# EAGLE design untitled (EAGLE 9.6.2)
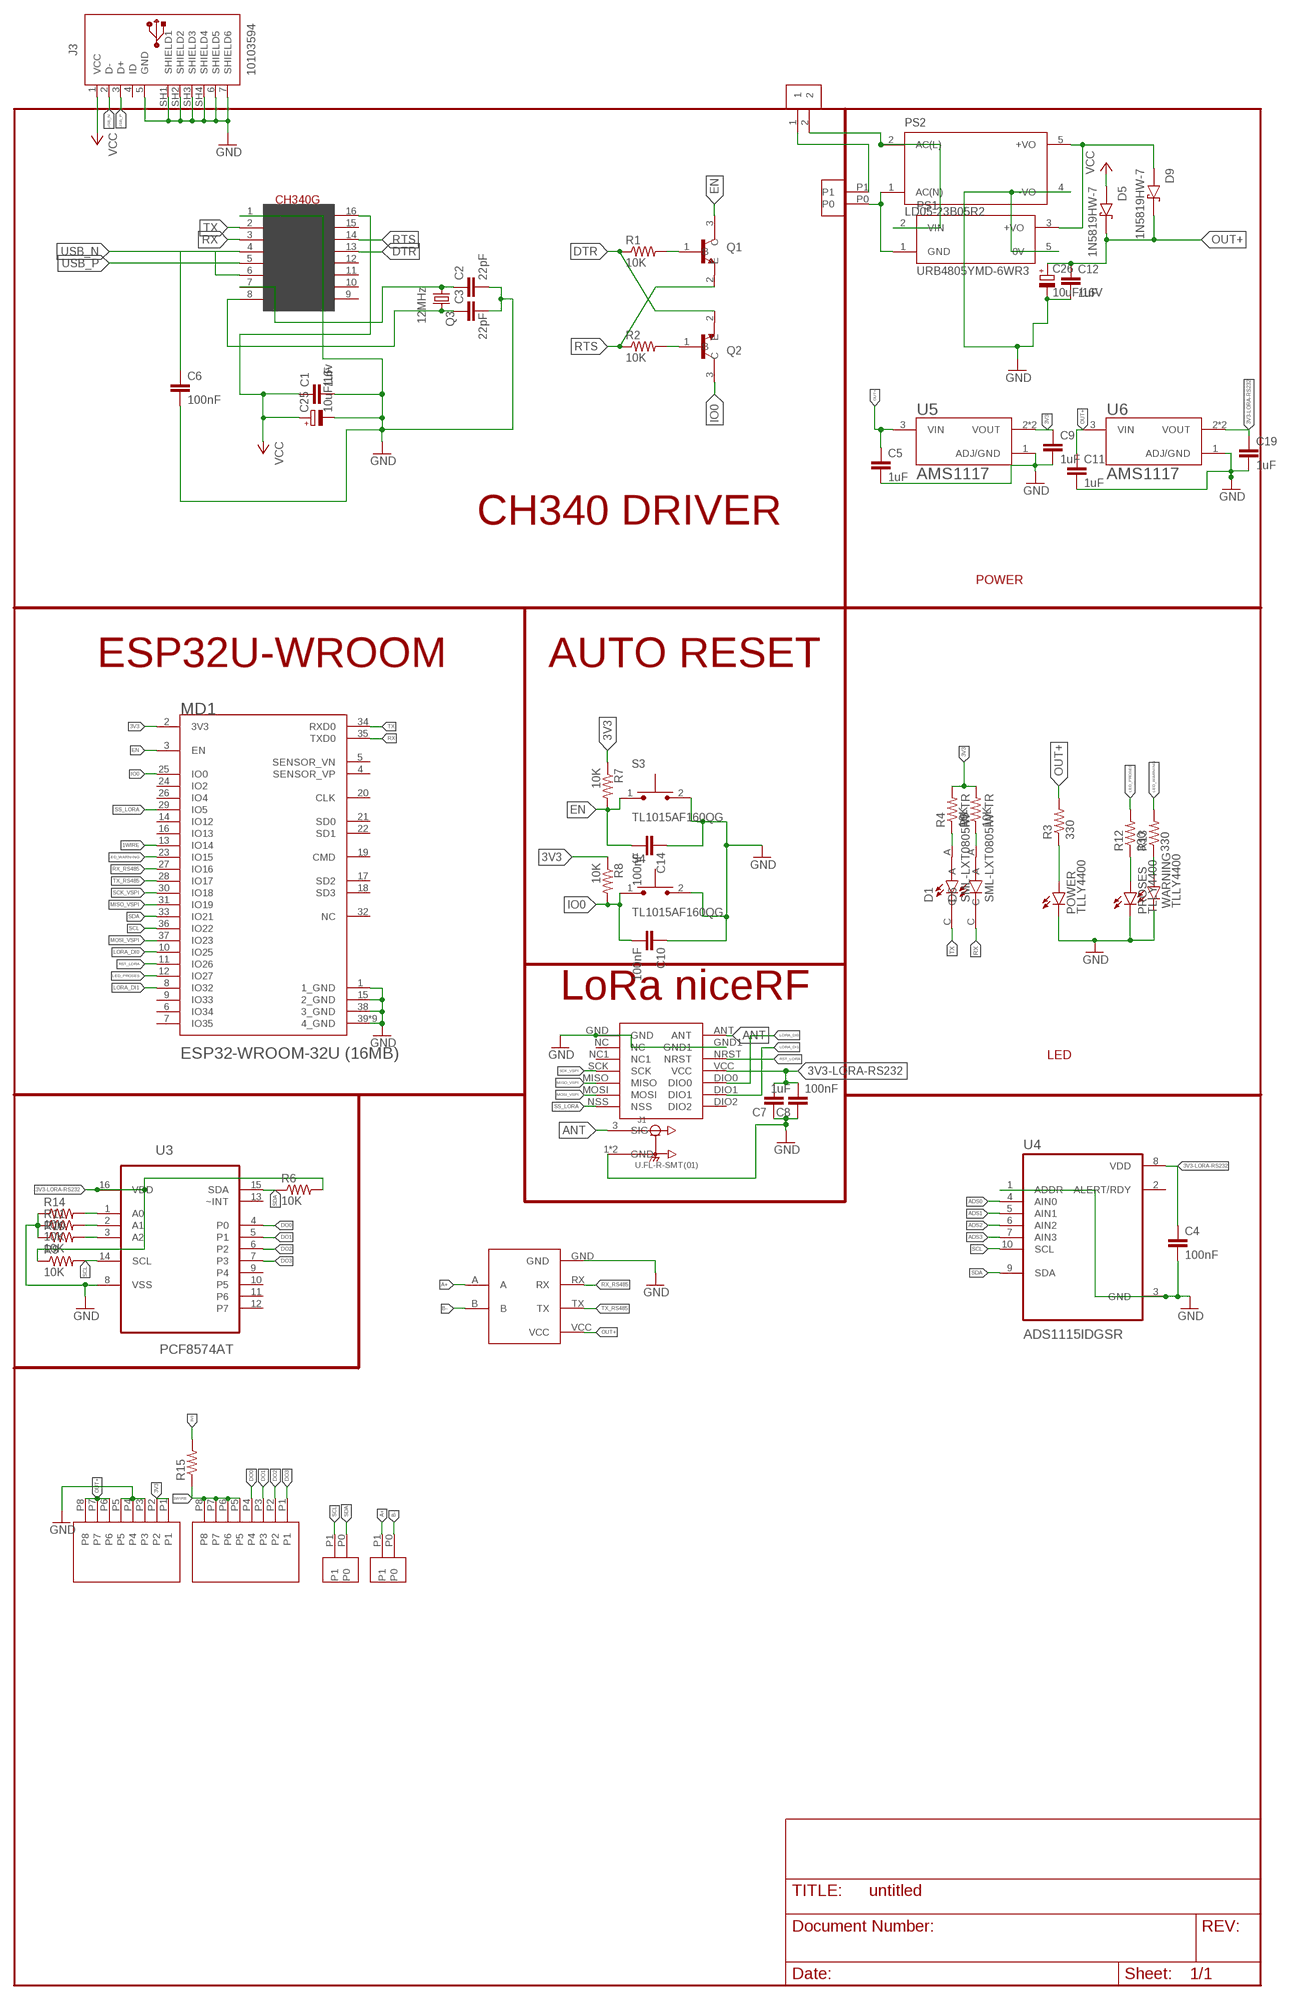
[diagram p0: schematic, sheet 1]

## Parts
C1  1uF  C-EUC0805K  [C0805K]
C2  22pF  C-EUC0805K  [C0805K]
C3  22pF  C-EUC0805K  [C0805K]
C4  100nF  C-EUC0805K  [C0805K]
C5  1uF  C-EUC0805K  [C0805K]
C6  100nF  C-EUC0805K  [C0805K]
C7  1uF  C-EUC0805K  [C0805K]
C8  100nF  C-EUC0805K  [C0805K]
C9  1uF  C-EUC0805K  [C0805K]
C10  100nF  C-EUC0805K  [C0805K]
C11  1uF  C-EUC0805K  [C0805K]
C12  1uF  C-EUC0805K  [C0805K]
C14  100nF  C-EUC0805K  [C0805K]
C19  1uF  C-EUC0805K  [C0805K]
C25  10uF/16v  CPOL-EU153CLV-0505  [153CLV-0505]
C26  10uF/16V  CPOL-EU153CLV-0505  [153CLV-0505]
CONN2P-3.5PI1  CONN2P-3.5PI  [CONN2P-3.5PI]
CONN2P-3.5PI2  CONN2P-3.5PI  [CONN2P-3.5PI]
CONN2P-3.5PI3  CONN2P-3.5PI  [CONN2P-3.5PI]
CONN3.1  CONN3.5  [CONN3.5]
CONN3.2  CONN3.5  [CONN3.5]
D1  SML-LXT0805IW-TR  [LEDC2012X120N]
D5  1N5819HW-7  [SOD3715X145N]
D6  SML-LXT0805IW-TR  [LEDC2012X120N]
D9  1N5819HW-7  [SOD3715X145N]
FUSE-KOTAK1  FUSE-KOTAK  [FUSE-KOTAK]
J1  U.FL-R-SMT(01)  [HRS_U.FL-R-SMT(01)]
J3  10103594  [10103594]
LORA-NICERF-V1  LORA-NICERF-V2  [LORA-NICERF-V2]
MD1  ESPRESSIF_SYSTEMS_ESP32-WROOM-32U_16MBESPRESSIF_SYSTEMS_ESP32-WROOM-32U_16MB_0_0  [ESPRESSIF_SYSTEMS_ESP32-WROOM-32U_16MB_0]
POWER  TLLY4400  [LED3MM]
PROSES  TLLY4400  [LED3MM]
PS1  URB4805YMD-6WR3  [CONV_URB4805YMD-6WR3]
PS2  LD05-23B05R2  [CONV_LD05-23B05R2]
Q1  MMBT3904  [SOT95P240X120-3N]
Q2  MMBT3904  [SOT95P240X120-3N]
Q3  12MHz  CRYSTALSM49  [SM49]
R1  10K  R-US_M0805  [M0805]
R2  10K  R-US_M0805  [M0805]
R3  330  R-US_M0805  [M0805]
R4  10K  R-US_M0805  [M0805]
R5  10K  R-US_M0805  [M0805]
R6  10K  R-US_M0805  [M0805]
R7  10K  R-US_M0805  [M0805]
R8  10K  R-US_M0805  [M0805]
R9  10K  R-US_M0805  [M0805]
R10  10K  R-US_M0805  [M0805]
R11  10K  R-US_M0805  [M0805]
R12  330  R-US_M0805  [M0805]
R13  330  R-US_M0805  [M0805]
R14  10K  R-US_M0805  [M0805]
R15  R-US_0207/10  [0207/10]
S3  TL1015AF160QG  [SW_TL1015AF160QG]
S4  TL1015AF160QG  [SW_TL1015AF160QG]
TTL-RS1  TTL-RS485  [TTL-RS485]
U3  PCF8574AT  [SOIC127P1032X265-16N]
U4  ADS1115IDGSR  [SOP50P490X110-10N]
U5  AMS1117  [SOT229P700X180-4N]
U6  AMS1117  [SOT229P700X180-4N]
U$2  CH340G  [SOIC16]
WARNING  TLLY4400  [LED3MM]

## Nets
1WIRE: CONN3.2.P5 CONN3.2.P6 CONN3.2.P7 CONN3.2.P8 MD1.13(IO14) R15.1
3V3: C9.1 CONN3.1.P1 CONN3.1.P2 MD1.2(3V3) R4.2 R5.2 R7.1 R8.1 R15.2 U5.2(VOUT) U5.4(VOUT)
3V3-LORA-RS232: C4.1 C7.2 C8.2 C19.1 LORA-NICERF-V1.VCC R6.2 R9.1 U3.16(VDD) U4.8(VDD) U6.2(VOUT) U6.4(VOUT)
A+: CONN2P-3.5PI3.P1 TTL-RS1.A
ADS0: U4.4(AIN0)
ADS1: U4.5(AIN1)
ADS2: U4.6(AIN2)
ADS3: U4.7(AIN3)
ANT: J1.3(SIG) LORA-NICERF-V1.ANT
B-: CONN2P-3.5PI3.P0 TTL-RS1.B
DO0: CONN3.2.P4 U3.4(P0)
DO1: CONN3.2.P3 U3.5(P1)
DO2: CONN3.2.P2 U3.6(P2)
DO3: CONN3.2.P1 U3.7(P3)
DTR: Q2.2(E) R1.1 U$2.13(DTR)
EN: C14.2 MD1.3(EN) Q1.3(C) R7.2 S3.1
GND: C1.2 C2.2 C3.2 C4.2 C5.2 C6.2 C7.1 C8.1 C9.2 C10.1 C11.2 C12.2 C14.1 C19.2 C25.- C26.- CONN3.1.P3 CONN3.1.P4 CONN3.1.P5 J1.1(GND) J1.2(GND) J3.5(GND) J3.6(SHIELD5) J3.7(SHIELD6) J3.SH1(SHIELD1) J3.SH2(SHIELD2) J3.SH3(SHIELD3) J3.SH4(SHIELD4) LORA-NICERF-V1.GND LORA-NICERF-V1.GND1 MD1.1(1_GND) MD1.15(2_GND) MD1.38(3_GND) MD1.39(4_GND) MD1.39-2(4_GND) MD1.39-3(4_GND) MD1.39-4(4_GND) MD1.39-5(4_GND) MD1.39-6(4_GND) MD1.39-7(4_GND) MD1.39-8(4_GND) MD1.39-9(4_GND) POWER.K(C) PROSES.K(C) PS1.5(0V) PS2.4(-VO) R10.1 R11.1 R14.1 S3.2 S4.2 TTL-RS1.GND U3.8(VSS) U4.1(ADDR) U4.3(GND) U5.1(ADJ/GND) U6.1(ADJ/GND) U$2.1(GND) WARNING.K(C)
IO0: C10.2 MD1.25(IO0) Q2.3(C) R8.2 S4.1
LED_PROSES: MD1.12(IO27) R12.2
LED_WARNING: MD1.23(IO15) R13.2
LORA_DI0: LORA-NICERF-V1.DIO0 MD1.10(IO25)
LORA_DI1: LORA-NICERF-V1.DIO1 MD1.8(IO32)
MISO_VSPI: LORA-NICERF-V1.MISO MD1.31(IO19)
MOSI_VSPI: LORA-NICERF-V1.MOSI MD1.37(IO23)
N$1: C2.1 Q3.1 U$2.7(XI)
N$2: C3.1 Q3.2 U$2.8(XO)
N$3: POWER.A R3.1
N$4: Q1.1(B) R1.2
N$5: Q2.1(B) R2.2
N$6: CONN2P-3.5PI1.P0 PS1.1(GND) PS2.1(AC(N))
N$7: CONN2P-3.5PI1.P1 FUSE-KOTAK1.1
N$8: D1.A R4.1
N$9: D6.A R5.1
N$10: R14.2 U3.1(A0)
N$12: C6.1 U$2.4(V3)
N$13: FUSE-KOTAK1.2 PS1.2(VIN) PS2.2(AC(L))
N$14: R11.2 U3.2(A1)
N$15: R10.2 U3.3(A2)
N$16: D9.A PS1.3(+VO) PS2.5(+VO)
N$25: PROSES.A R12.1
N$28: R13.1 WARNING.A
OUT+: C5.1 C11.1 C12.1 C26.+ CONN3.1.P6 CONN3.1.P7 CONN3.1.P8 D5.C(K) D9.C(K) R3.2 TTL-RS1.VCC U5.3(VIN) U6.3(VIN)
RST_LORA: LORA-NICERF-V1.NRST MD1.11(IO26)
RTS: Q1.2(E) R2.1 U$2.14(RTS)
RX: D6.C MD1.35(TXD0) U$2.3(RX)
RX_RS485: MD1.27(IO16) TTL-RS1.RX
SCK_VSPI: LORA-NICERF-V1.SCK MD1.30(IO18)
SCL: CONN2P-3.5PI2.P1 MD1.36(IO22) R9.2 U3.14(SCL) U4.10(SCL)
SDA: CONN2P-3.5PI2.P0 MD1.33(IO21) R6.1 U3.15(SDA) U4.9(SDA)
SS_LORA: LORA-NICERF-V1.NSS MD1.29(IO5)
TX: D1.C MD1.34(RXD0) U$2.2(TX)
TX_RS485: MD1.28(IO17) TTL-RS1.TX
USB_N: J3.2(D-) U$2.6(D-)
USB_P: J3.3(D+) U$2.5(D+)
VCC: C1.1 C25.+ D5.A J3.1(VCC) U$2.16(VCC)
Unconnected: J3.4(ID) LORA-NICERF-V1.DIO2 LORA-NICERF-V1.NC LORA-NICERF-V1.NC1 MD1.4(SENSOR_VP) MD1.5(SENSOR_VN) MD1.6(IO34) MD1.7(IO35) MD1.9(IO33) MD1.14(IO12) MD1.16(IO13) MD1.17(SD2) MD1.18(SD3) MD1.19(CMD) MD1.20(CLK) MD1.21(SD0) MD1.22(SD1) MD1.24(IO2) MD1.26(IO4) MD1.32(NC) U3.9(P4) U3.10(P5) U3.11(P6) U3.12(P7) U3.13(~INT) U4.2(ALERT/RDY) U$2.9(CTS) U$2.10(DSR) U$2.11(RI) U$2.12(DCD) U$2.15(RS232)

## Notes on the sheet
- CH340 DRIVER
- POWER
- ESP32U-WROOM | AUTO RESET
- LoRa niceRF
- LED

## Library data of the parts
C1-C12 C14 C19 = rcl:C-EU: CAPACITOR, European symbol; SPICEPREFIX: C
C25 C26 = rcl:CPOL-EU: POLARIZED CAPACITOR, European symbol; SPICEPREFIX: C
CONN2P-3.5PI1-CONN2P-3.5PI3 = CONN2P-3.5PI:CONN2P-3.5PI
CONN3.1 CONN3.2 = CONN3.5:CONN3.5
D1 D6 = SML-LXT0805IW-TR:SML-LXT0805IW-TR: LED; Luminous Intensity:11µcd; Viewing Angle:140°; Forward Current:30mA; Forward Voltage:2V; Color:Red; LED Color:Red; Leaded Process Compatible:Yes; Lens Color:White; Mounting Type:Surface Mount ;RoHS Compliant: Yes Check availability <https://pricing.snapeda.com/parts/SML-LXT0805IW-TR/Lumex%20Opto/Components/view-part?ref=eda>; AVAILABILITY: In Stock; DESCRIPTION: Red - LED Indication - Discrete 2V 0805 (2012 Metric); MF: Lumex Opto/Components; MP: SML-LXT0805IW-TR; PACKAGE: 0805 Lumex; PRICE: None; PURCHASE-URL: https://pricing.snapeda.com/search/part/SML-LXT0805IW-TR/?ref=eda
D5 D9 = 1N5819HW-7:1N5819HW-7: 1N5819HW Series 40 V 1 A Surface Mount Schottky Barrier Rectifier - SOD-123 Check availability <https://pricing.snapeda.com/parts/1N5819HW-7/Diodes%20Inc./view-part?ref=eda>; AVAILABILITY: In Stock; DESCRIPTION: Diode Schottky 40 V 1A Surface Mount SOD-123; MF: Diodes Inc.; MP: 1N5819HW-7; PACKAGE: SOD-123 Fairchild Semiconductor; PRICE: None; PURCHASE-URL: https://pricing.snapeda.com/search/part/1N5819HW-7/?ref=eda
FUSE-KOTAK1 = FUSE-KOTAK:FUSE-KOTAK
J1 = U.FL-R-SMT_01_:U.FL-R-SMT(01): U.FL Series 6 Ghz 50 Ohm Ultra-small SMT Coaxial Cable Receptacle Check availability <https://pricing.snapeda.com/parts/U.FL-R-SMT%2801%29/Hirose/view-part?ref=eda>; AVAILABILITY: In Stock; DESCRIPTION: U.FL (UMCC) Connector Receptacle, Male Pin 50Ohm Surface Mount Solder. RF Connectors / Coaxial Connectors; MF: Hirose; MP: U.FL-R-SMT(01); PACKAGE: None; PRICE: None; PURCHASE-URL: https://pricing.snapeda.com/search/part/U.FL-R-SMT(01)/?ref=eda
J3 = Connector_USB:10103594: USB(2.0) Micro-B, RCPT, 5POS, SMD-THT-R/A Datasheet <https://cdn.amphenol-icc.com/media/wysiwyg/files/documentation/datasheet/inputoutput/io_usb_micro.pdf> Drawing <https://cdn.amphenol-icc.com/media/wysiwyg/files/drawing/10103594.pdf>; CATEGORY: Connectors; CONTACTS: 5; CURRENT-RATING: 1.8A; DESCRIPTION: CONN RCPT USB2.0 MICRO B SMD R/A; GENDER: Receptacle; MANUFACTURER: Amphenol ICC (FCI); MOUNT_TYPE: R/A; MPN: 10103594-0001LF; OPERATING_TEMPERATURE: -30°C ~ 80°C; PART_STATUS: ACTIVE; ROHS_COMPLIANT: COMPLIANT; SUB_CATEGORY: USB; TYPE: USB-micro B; VOLTAGE-RATING: 100VAC
LORA-NICERF-V1 = LORA-NICERF-V2:LORA-NICERF-V2
MD1 = Espressif Systems - ESP32-WROOM-32U (16MB):ESPRESSIF_SYSTEMS_ESP32-WROOM-32U_16MB: Bluetooth, WiFi 802.11b/g/n, Bluetooth v4.2 +EDR, Class 1, 2 and 3 Transceiver Module 2.4GHz ~ 2.5GHz Antenna Not Included, U.FL Surface Mount; AUTOMOTIVE: No; BANDWIDTH: 72MHz; CENTROID_NOT_SPECIFIED: No; DATASHEET: https://www.espressif.com/sites/default/files/documentation/esp32-wroom-32d_esp32-wroom-32u_datasheet_en.pdf; DATA_RATE: 150Mbits/s; DEVICE_CLASS_L1: Integrated Circuits (ICs); DEVICE_CLASS_L2: RF Semiconductors and Devices; DEVICE_CLASS_L3: Transceivers; DIGIKEY_DESCRIPTION: RX TXRX MODULE WIFI U.FL SMD; DIGIKEY_PART_NUMBER: 1904-1028-1-ND; FOOTPRINT_VARIANT_NAME_0: Recommended_Land_Pattern; HEIGHT: 3.35mm; INTERFACE: I2C,SPI,UART,Ethernet,I2S,Other; LEAD_FREE: Yes; MAX_FREQUENCY: 2484MHz; MAX_SUPPLY_VOLTAGE: 3.6V; MF: Espressif Systems; MFG_PACKAGE_IDENT: 0; MFG_PACKAGE_IDENT_DATE: 0; MFG_PACKAGE_IDENT_REV: 0; MIN_SUPPLY_VOLTAGE: 3V; MOUSER_PART_NUMBER: 356-ES32WROOM32U16MB; MPN: ESP32-WROOM-32U (16MB); NOMINAL_SUPPLY_CURRENT: 0.5A; NUMBER_OF_ADC_CHANNELS: 16; NUMBER_OF_GPIO: 26; PACKAGE: BT_MODULE; PREFIX: MD; ROHS: Yes; SENSITIVITY: -98dBm; TEMPERATURE_RANGE_HIGH: +85°C; TEMPERATURE_RANGE_LOW: -40°C; VERIFICATION_VERSION: 0.0.0.3
POWER PROSES WARNING = led:TLLY4400: Low Current (2mA) LED 3 mm Tinted Diffused Package color YELLOW Source: Data sheet <http://www.farnell.com/datasheets/391098.pdf>; MF: VISHAY SEMICONDUCTOR; OC_FARNELL: 1612439
PS1 = URB4805YMD-6WR3:URB4805YMD-6WR3: DC/DC Converter Check availability <https://pricing.snapeda.com/parts/URB4805YMD-6WR3/Mornsun%20America%2C%20LLC/view-part?ref=eda>; AVAILABILITY: In Stock; DESCRIPTION: Isolated Module DC DC Converter 1 Output 5V - - - 1.2A 18V - 75V Input; MF: Mornsun America, LLC; MP: URB4805YMD-6WR3; PACKAGE: CUSTOM-5 MORNSUN; PRICE: None; PURCHASE-URL: https://pricing.snapeda.com/search?q=URB4805YMD-6WR3&ref=eda
PS2 = LD05-23B05R2:LD05-23B05R2: AC/DC Converter Check availability <https://pricing.snapeda.com/parts/LD05-23B05R2/Mornsun%20America%2C%20LLC/view-part?ref=eda>; AVAILABILITY: In Stock; DESCRIPTION: Enclosed AC DC Converters 1 Uitgang 5V - - - 1A 85 ~ 305 VAC, 100 ~ 430 VDC Input; MF: Mornsun America, LLC; MP: LD05-23B05R2; PACKAGE: CUSTOM-4 MORNSUN; PRICE: None; PURCHASE-URL: https://pricing.snapeda.com/search/part/LD05-23B05R2/?ref=eda
Q1 Q2 = MMBT3904:MMBT3904: MMBT3904 Series 40 V CE Breakdown 0.2 A NPN General Purpose Amplifier - SOT-23 Check availability <https://pricing.snapeda.com/parts/MMBT3904/STMicroelectronics/view-part?ref=eda>; AVAILABILITY: Not in stock; DESCRIPTION: SMD Transistor MMBT3904 SOT-23 SMD DIOTEC; MF: STMicroelectronics; MP: MMBT3904; PACKAGE: SOT-23 ON; PRICE: None
Q3 = adafruit:CRYSTAL: CRYSTAL; OC_FARNELL: unknown; OC_NEWARK: unknown
R1-R15 = adafruit:R-US_: RESISTOR, American symbol
S3 S4 = TL1015AF160QG:TL1015AF160QG: Tactile Switch SPST-NO Top Actuated Surface Mount Check availability <https://pricing.snapeda.com/parts/TL1015AF160QG/E-Switch/view-part?ref=eda>; AVAILABILITY: In Stock; DESCRIPTION: Tactile Switch SPST-NO Top Actuated Surface Mount; MF: E-Switch; MP: TL1015AF160QG; PACKAGE: None; PRICE: None; PURCHASE-URL: https://pricing.snapeda.com/search/part/TL1015AF160QG/?ref=eda
TTL-RS1 = TTL-RS485:TTL-RS485
U3 = PCF8574AT:PCF8574AT: Remote 8-bit I/O expander for I2C-bus Check availability <https://pricing.snapeda.com/parts/PCF8574AT/NXP%20USA/view-part?ref=eda>; AVAILABILITY: In Stock; DESCRIPTION: I²C Bus IC Operating temperature: -40...+85 °C Power supply: 2.5...6 V Package: SO-16W; MF: NXP USA; MP: PCF8574AT; PACKAGE: SOIC-16 NXP USA; PRICE: None; PURCHASE-URL: https://pricing.snapeda.com/search/part/PCF8574AT/?ref=eda
U4 = ADS1115IDGSR:ADS1115IDGSR: Check availability <https://pricing.snapeda.com/parts/ADS1115IDGSR/Texas%20Instruments/view-part?ref=eda>; AVAILABILITY: In Stock; DESCRIPTION: 16-bit, 860-SPS, 4-channel, delta-sigma ADC with PGA, oscillator, VREF, comparator and I2C; MF: Texas Instruments; MP: ADS1115IDGSR; PACKAGE: VSSOP-10 Texas Instruments; PRICE: None; PURCHASE-URL: https://pricing.snapeda.com/search/part/ADS1115IDGSR/?ref=eda
U5 U6 = AMS1117:AMS1117: Sot223/Pkg 1-Amp 5-Volt Low Drop Out Voltage Regulatator Check availability <https://pricing.snapeda.com/parts/AMS1117/Advanced%20Monolithic%20Systems/view-part?ref=eda>; AVAILABILITY: Not in stock; DESCRIPTION: 1A LOW DROPOUT VOLTAGE REGULATOR SOT-223; MF: Advanced Monolithic Systems; MP: AMS1117; PACKAGE: SOT-223 Seeed Technology; PRICE: None
U$2 = usb-serial:CH340G

## Net classes
0 default: width 0.2 mm, clearance 0.15 mm

## Board
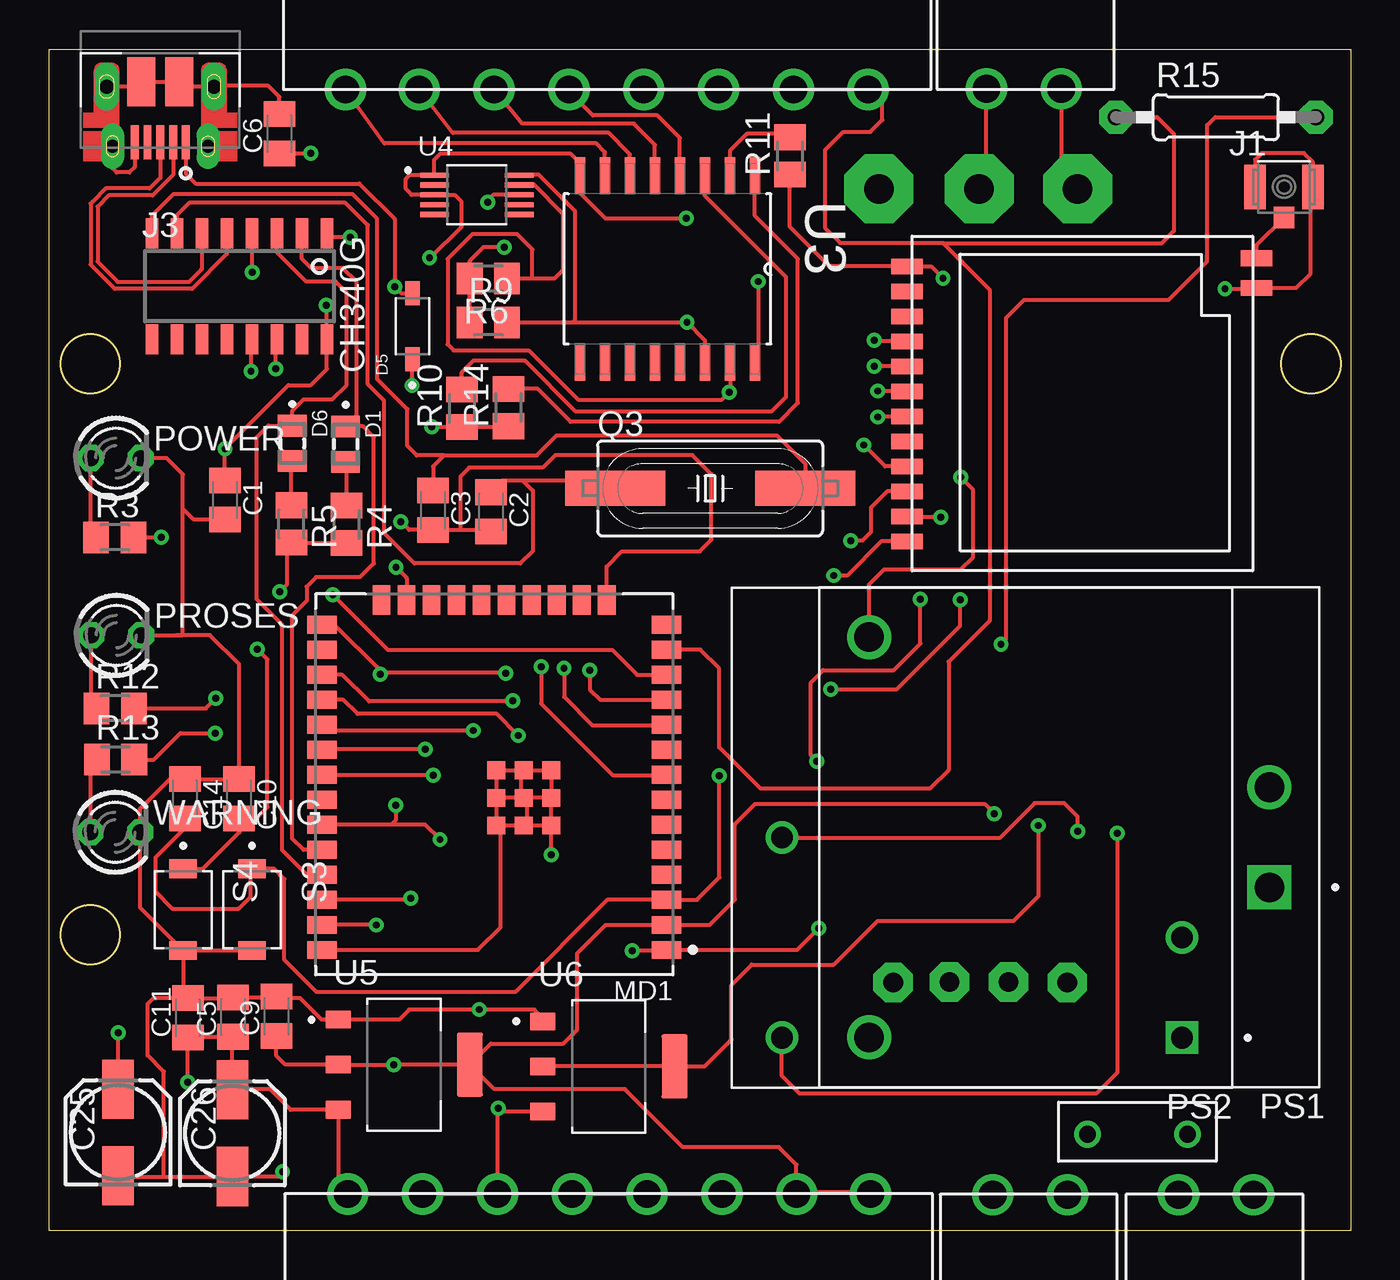
[diagram p1: board, top side]
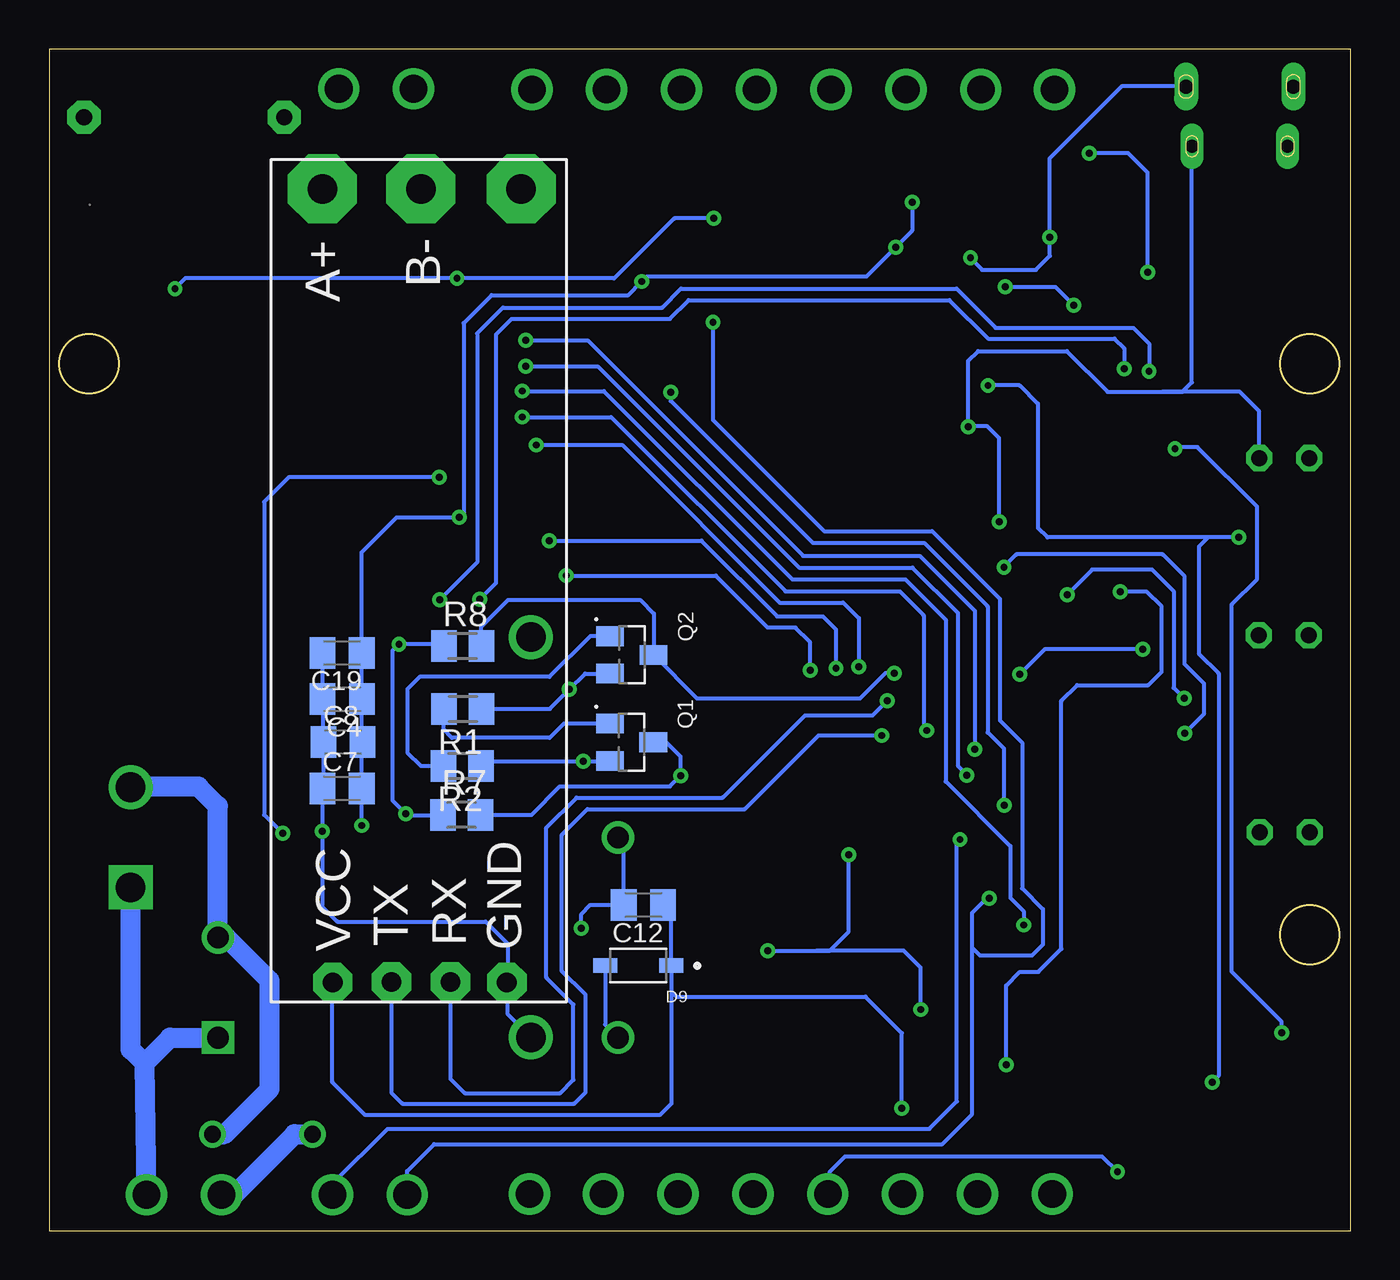
[diagram p2: board, bottom side, seen from below]

Size 66.1 x 60 mm. Coordinates in mm from the lower left corner, seen from the top.
Outline: 66.1,0 0,0 0,60 66.1,60 66.1,0
Outline: circle at 64.08,44.04 radius 1.5
Outline: circle at 2.08,44.04 radius 1.5
Outline: circle at 2.08,15.04 radius 1.5
Copper layers (1*16): Top 0.035mm / dielectric 1.5mm / Bottom 0.035mm
Design rules "default": minimum track width 6mil, minimum drill 0.35mm, track to track 6mil, track to pad 6mil, pad to pad 6mil, via to via 6mil, smd to smd 6mil, copper to edge 40mil, drill to drill 6mil, minimum pad ring 10mil, minimum via ring 8mil, stop-mask expansion 4mil, vias tented up to drill 0mil, thermal gap 10mil

### Footprints (pad centres in the part's own frame; a part is rotated, then mirrored left to right if it is on the bottom)
C0805K = smd 1.3 x 1.6: 1 -1,0; 2 1,0
153CLV-0505 = smd 3 x 1.6: + 2.2,0; - -2.2,0
CONN2P-3.5PI = drill 1.4: P0 2.521,0.016; P1 6.321,0.016
CONN3.5 = drill 1.4: P1 -26.75,0; P2 -23,0; P3 -19.2,0; P4 -15.4,0; P5 -11.6,0; P6 -7.8,0; P7 -4,0; P8 -0.2,0
LEDC2012X120N = smd 1.1 x 1.45: A 0.9,0; C -0.9,0
SOD3715X145N = smd 1.21 x 0.73: A 1.68,0; C -1.68,0
FUSE-KOTAK = drill 0.85: 1 -5.54,-0.62; 2 -0.46,-0.62
HRS_U.FL-R-SMT(01) = smd 1.1 x 2.25: 1 -1.475,0; 2 1.475,0 | smd 1.05 x 1.1: 3 0,-1.55
10103594 = smd 0.4 x 1.75: 1 -1.3,2.825; 2 -0.65,2.825; 3 0,2.825; 4 0.65,2.825; 5 1.3,2.825 | smd 1.425 x 2.5: 6 -0.963,-0.25; 7 0.963,-0.25 | drill 0.65 pad 0.73 long: SH1 -2.425,3.03; SH2 2.425,3.03 | drill 0.7 long: SH3 -2.725,0; SH4 2.725,0
LORA-NICERF-V2 = smd 1.6 x 0.8: ANT 9.17,6.81; DIO0 -8.57,-5.03; DIO1 -8.57,-3.76; DIO2 -8.57,-2.49; GND -8.57,6.4; GND1 9.17,5.31; MISO -8.57,1.32; MOSI -8.57,0.05; NC -8.57,5.13; NC1 -8.57,3.86; NRST -8.57,-7.57; NSS -8.57,-1.22; SCK -8.57,2.59; VCC -8.57,-6.3
ESPRESSIF_SYSTEMS_ESP32-WROOM-32U_16MB_0 = smd 1.5 x 0.9: 1 -8.75,8.41; 2 -8.75,7.14; 3 -8.75,5.87; 4 -8.75,4.6; 5 -8.75,3.33; 6 -8.75,2.06; 7 -8.75,0.79; 8 -8.75,-0.48; 9 -8.75,-1.75; 10 -8.75,-3.02; 11 -8.75,-4.29; 12 -8.75,-5.56; 13 -8.75,-6.83; 14 -8.75,-8.1; 25 8.75,-8.1; 26 8.75,-6.83; 27 8.75,-5.56; 28 8.75,-4.29; 29 8.75,-3.02; 30 8.75,-1.75; 31 8.75,-0.48; 32 8.75,0.79; 33 8.75,2.06; 34 8.75,3.33; 35 8.75,4.6; 36 8.75,5.87; 37 8.75,7.14; 38 8.75,8.41 | smd 0.9 x 1.5: 15 -5.71,-9.35; 16 -4.44,-9.35; 17 -3.17,-9.35; 18 -1.9,-9.35; 19 -0.63,-9.35; 20 0.64,-9.35; 21 1.91,-9.35; 22 3.18,-9.35; 23 4.45,-9.35; 24 5.72,-9.35 | smd 0.9 x 0.9: 39 -2.9,2.09; 39-2 -1.5,0.69; 39-3 -1.5,2.09; 39-4 -0.1,2.09; 39-5 -0.1,-0.71; 39-6 -1.5,-0.71; 39-7 -2.9,-0.71; 39-8 -0.1,0.69; 39-9 -2.9,0.69
LED3MM = drill 0.813 octagon: A -1.27,0; K 1.27,0
CONV_URB4805YMD-6WR3 = drill 1.5 square: 1 -10.16,2.54 | drill 1.5: 2 -10.16,-2.54; 3 10.16,-10.16; 5 10.16,10.16
CONV_LD05-23B05R2 = drill 1.1 square: 1 -10.16,10.16 | drill 1.1: 2 -10.16,5.08; 4 10.16,0; 5 10.16,10.16
SOT95P240X120-3N = smd 1 x 1.4: 1 -0.95,-1.1; 2 0.95,-1.1; 3 0,1.1
SM49 = smd 5.08 x 1.778: 1 -4.826,0; 2 4.826,0
M0805 = smd 1.3 x 1.6: 1 -0.95,0; 2 0.95,0
0207/10 = drill 0.813 pad 1.676 octagon: 1 -5.08,0; 2 5.08,0
SW_TL1015AF160QG = smd 0.95 x 1.4: 1 -2.075,0; 2 2.075,0
TTL-RS485 = drill 1.5 pad 3.5 octagon: A -19.7,-6; B -19.7,-1; P$7 -19.7,4.1 | drill 1 pad 2 octagon: GND 20.6,3.37; RX 20.581,0.505; TX 20.583,-2.493; VCC 20.6,-5.47
SOIC127P1032X265-16N = smd 1.803 x 0.533: 1 -4.775,4.445; 2 -4.775,3.175; 3 -4.775,1.905; 4 -4.775,0.635; 5 -4.775,-0.635; 6 -4.775,-1.905; 7 -4.775,-3.175; 8 -4.775,-4.445; 9 4.775,-4.445; 10 4.775,-3.175; 11 4.775,-1.905; 12 4.775,-0.635; 13 4.775,0.635; 14 4.775,1.905; 15 4.775,3.175; 16 4.775,4.445
SOP50P490X110-10N = smd 1.47 x 0.28: 1 -2.15,1; 2 -2.15,0.5; 3 -2.15,0; 4 -2.15,-0.5; 5 -2.15,-1; 6 2.15,-1; 7 2.15,-0.5; 8 2.15,0; 9 2.15,0.5; 10 2.15,1
SOT229P700X180-4N = smd 1.31 x 0.93: 1 -3.345,2.29; 2 -3.345,0; 3 -3.345,-2.29 | smd 1.31 x 3.24: 4 3.345,0
SOIC16 = smd 0.635 x 1.524: 1 -4.445,-2.695; 2 -3.175,-2.695; 3 -1.905,-2.695; 4 -0.635,-2.695; 5 0.635,-2.695; 6 1.905,-2.695; 7 3.175,-2.695; 8 4.445,-2.695; 9 4.445,2.695; 10 3.175,2.695; 11 1.905,2.695; 12 0.635,2.695; 13 -0.635,2.695; 14 -1.905,2.695; 15 -3.175,2.695; 16 -4.445,2.695

### Placement (x,y rotation side)
C1  8.93,37.11 270 top
C2  22.44,36.5 270 top
C3  19.49,36.59 270 top
C4  51.22,26.99 180 bottom
C5  9.34,10.85 90 top
C6  11.69,55.7 90 top
C7  51.23,22.46 0 bottom
C8  51.18,24.81 0 bottom
C9  11.54,10.89 90 top
C10  9.64,21.93 270 top
C11  7.04,10.81 90 top
C12  35.92,16.54 180 bottom
C14  6.89,21.93 270 top
C19  51.23,29.34 180 bottom
C25  3.5,4.99 90 top
C26  9.3,4.95 90 top
CONN2P-3.5PI1  63.68,1.84 180 top
CONN2P-3.5PI2  54.24,1.84 180 top
CONN2P-3.5PI3  45.08,57.98 0 top
CONN3.1  14.96,1.87 180 top
CONN3.2  41.79,57.96 0 top
D1  15.05,39.94 270 top
D5  18.44,45.93 90 top
D6  12.34,39.98 270 top
D9  36.19,13.46 180 bottom
FUSE-KOTAK1  58.27,5.52 0 top
J1  62.71,53 0 top
J3  5.64,58.1 180 top
LORA-NICERF-V1  52.14,42.57 0 top
MD1  22.6,22.67 180 top
POWER  3.38,39.24 0 top
PROSES  3.41,30.24 0 top
PS1  51.8,19.98 180 top
PS2  47.37,19.96 180 top
Q1  36.52,24.8 270 bottom
Q2  36.51,29.24 270 bottom
Q3  33.56,37.7 0 top
R1  45.1,26.5 180 bottom
R2  45.12,23.6 180 bottom
R3  3.33,35.21 0 top
R4  15.1,35.87 270 top
R5  12.29,35.89 270 top
R6  22.31,48.36 180 top
R7  45.16,21.12 0 bottom
R8  45.1,29.68 0 bottom
R9  22.31,46.12 0 top
R10  20.96,41.77 90 top
R11  37.61,54.58 90 top
R12  3.35,26.52 0 top
R13  3.37,23.92 0 top
R14  23.32,41.8 90 top
R15  59.25,56.55 0 top
S3  10.3,16.3 270 top
S4  6.8,16.3 270 top
TTL-RS1  46.23,33.21 270 bottom
U3  31.4,48.85 270 top
U4  21.72,52.61 0 top
U5  18.02,8.43 0 top
U6  28.42,8.34 0 top
U$2  9.66,47.97 180 top
WARNING  3.35,20.24 0 top

### Tracks (layer width: path | path; a pad name or v marks a point on that pad's centre or on a via)
1WIRE
  Top 0.203: 45.42,50.13 47.76,47.8 47.76,30.98 45.67,28.9 45.67,23.39 44.73,22.44 36.13,22.44 34.02,24.55 34.02,28.56 33.07,29.51 MD1.13 | CONN3.2.P5 CONN3.2.P6 CONN3.2.P7 CONN3.2.P8 42.31,57.94 42.31,56.41 41.7,55.8 40.33,55.8 39.39,54.86 39.39,50.95 40.16,50.17 45.39,50.17 45.42,50.13 | R15.1 56.27,56.55 57.12,55.7 57.12,50.77 56.48,50.13 45.42,50.13
3V3  (via drill 0.35)
  Top 0.203: 12.27,34.96 R5.2 | U5.4 v17.5,8.43 U5.2 11.99,8.43 11.54,8.88 C9.1 | CONN3.1.P2 38.46,1.95 | U5.4 22.61,7.18 29.23,7.18 32.17,4.24 37.06,4.24 37.94,3.36 37.94,1.95 38.46,1.95 | CONN3.1.P1 42.38,1.95 38.46,1.95 | U5.4 22.44,9.5 26.1,9.5 26.81,10.2 26.81,14.08 28.25,15.53 MD1.2 33.53,15.53 34.82,16.81 34.82,20.64 35.85,21.67 47.5,21.67 v48,21.17 | v48.33,29.79 48.6,30.05 48.6,46.36 49.51,47.27 56.85,47.27 58.81,49.23 58.81,56.14 59.22,56.55 R15.2 | R5.2 15.08,34.94 R4.2 | v11.71,32.45 12.06,32.8 12.06,34.71 R5.2
  Bottom 0.203: R7.1 46.14,21.09 47.91,21.09 v48,21.17 48.64,21.82 48.64,29.48 v48.33,29.79 46.16,29.79 R8.1 | v17.5,8.43 17.5,12.44 16.8,13.14 15.87,13.14 14.7,14.31 14.7,26.9 13.9,27.7 10.29,27.7 9.61,28.38 9.61,31.7 10.35,32.45 v11.71,32.45
3V3-LORA-RS232  (via drill 0.35)
  Top 0.203: U6.2 U6.4 33.29,8.34 34.65,9.7 34.65,12.47 35.68,13.51 39.84,13.51 42.07,15.74 48.98,15.74 50.25,17 50.25,20.56 v50.23,20.58 | R9.1 R6.2 21.36,49.25 22.05,49.95 v23.11,49.95 | v45.27,36.22 43.62,36.22 LORA-NICERF-V1.VCC | v36,48.2 36,44.23 U3.16 | v22.28,52.23 22.28,52.33 22.55,52.61 U4.8
  Bottom 0.203: v50.23,20.58 C7.2 50.23,24.76 C8.2 50.25,24.88 50.25,26.96 C4.1 C19.1 50.23,34.45 48.46,36.22 v45.27,36.22 45.06,36.44 45.06,46.1 43.64,47.52 36.69,47.52 v36,48.2 35.74,48.46 24.59,48.46 23.11,49.94 v23.11,49.95 22.28,50.78 v22.28,52.23
A+
  Top 0.203: CONN2P-3.5PI3.P1 51.4,53.74 TTL-RS1.A
ANT
  Top 0.203: J1.3 61.31,50.05 LORA-NICERF-V1.ANT
B-
  Top 0.203: TTL-RS1.B 47.6,53.28 CONN2P-3.5PI3.P0
DO0
  Top 0.203: U3.4 32.03,55.5 30.89,56.64 27.61,56.64 26.29,57.96 CONN3.2.P4
DO1
  Top 0.203: U3.5 30.76,55.14 29.69,56.22 24.03,56.22 CONN3.2.P3
DO2
  Top 0.203: U3.6 29.49,54.66 28.4,55.75 20.5,55.75 CONN3.2.P2
DO3
  Top 0.203: U3.7 28.22,54.78 27.77,55.22 17.03,55.22 CONN3.2.P1
DTR  (via drill 0.35)
  Top 0.203: v39.68,27.5 43.05,27.5 46.26,30.71 v46.26,32.05 | v10.25,43.65 10.25,45.23 U$2.13
  Bottom 0.203: R1.1 40.68,26.5 v39.68,27.5 38.89,28.29 Q2.2 | v46.26,32.05 44.37,33.94 44.37,45.57 43.06,46.88 34.98,46.88 34.02,47.84 20.02,47.84 18.03,45.85 11.04,45.85 10.23,45.05 10.23,43.67 v10.25,43.65
EN  (via drill 0.35)
  Top 0.203: 10.23,18.45 S3.1 11.42,18.38 11.95,17.85 11.95,13.75 13.59,12.11 23.66,12.11 28.35,16.8 MD1.3 32.89,16.8 34.03,17.94 v34.03,23.11 | 10.23,18.45 9.96,18.71 | C14.2 6.89,20.45 5.39,18.95 5.39,17.23 6.26,16.36 9.62,16.36 10.23,16.97 10.23,18.45
  Bottom 0.203: Q1.3 34.77,24.8 34.03,24.06 v34.03,23.11 34.58,22.56 40.17,22.56 41.61,21.12 R7.2
GND  (via drill 0.35)
  Top 0.203: J3.5 4.34,54.01 4.07,53.74 3.42,53.74 3.22,53.95 3.22,55.02 | 3.22,55.02 J3.SH2 | J3.SH4 2.92,58.09 | 2.92,58.09 2.92,55.32 3.22,55.02 | 2.92,58.09 4.42,58.09 J3.7 J3.6 6.85,58.1 J3.SH3 | J3.SH3 8.37,55.37 J3.SH1 | J1.1 61.24,54.39 61.57,54.72 63.71,54.72 64.19,54.25 J1.2 64.06,52.87 64.06,48.61 63.33,47.88 LORA-NICERF-V1.GND1 61.27,47.84 v59.72,47.84 | R14.1 23.26,40.79 23.23,40.82 R10.1 v19.43,40.82 | PROSES.K 6.46,30.24 | 6.46,30.24 6.79,30.24 6.79,36.66 | 6.79,36.66 6.79,38.4 5.96,39.24 POWER.K | C1.2 7.34,36.11 6.79,36.66 | C25.- 3.54,2.75 5.82,2.75 | 5.82,2.75 C26.- 11.61,2.75 v11.85,2.99 | 20.94,35.59 C3.2 18.28,35.59 v17.87,36 v17.86,36 | 20.94,35.59 22.36,35.59 C2.2 | 7.06,11.81 C11.2 5.3,11.82 5,11.51 5,8.9 5.82,8.07 5.82,2.75 | 7.06,11.81 9.3,11.81 C5.2 11.5,11.85 C9.2 11.62,11.81 12.74,11.81 13.83,10.72 U5.1 17.77,10.72 18.28,11.23 v21.84,11.23 24.64,11.23 25.08,10.79 U6.1 | S3.2 S4.2 | S4.2 6.8,12.07 7.06,11.81 | S4.2 4.62,16.41 WARNING.K 4.62,21.43 6.14,22.95 6.87,22.95 C14.1 7.08,22.93 | CONN3.1.P5 CONN3.1.P4 CONN3.1.P3 | C6.2 11.69,57.58 11.13,58.13 8.4,58.13 J3.SH3 | 23.98,23.38 MD1.39-5 MD1.39-8 | 23.98,23.38 MD1.39-6 MD1.39-7 MD1.39-9 | MD1.39-9 MD1.39-2 | MD1.39-2 MD1.39-8 | MD1.39-8 MD1.39-4 22.92,20.58 | 22.92,20.58 MD1.39-3 24.25,20.58 | 24.25,20.58 MD1.39 | MD1.39 MD1.39-9 | R11.1 37.61,50.98 39.62,48.97 LORA-NICERF-V1.GND 44.79,48.97 v45.39,48.37 | 19.53,53.64 U4.1 | 19.53,53.64 19.53,54.37 19.85,54.69 26.49,54.69 26.95,54.23 U3.8 26.95,52.71 28.25,51.41 v32.35,51.41 v32.36,51.41 | 19.53,53.64 19.53,53.62 18.31,53.62 18.11,53.42 18.11,52.9 18.41,52.61 U4.3 20.59,52.61 20.92,52.28 20.92,50.97 19.35,49.4 v19.31,49.4
  Top 0.203: v52.23,20.28 52.23,21.02 51.54,21.71 50.05,21.71 48.27,19.94 37.23,19.94 PS2.4 | v39.08,15.35 37.99,14.26 MD1.1 31.3,14.21 v29.61,14.21 | 7.08,22.93 C10.1 9.64,28.77 8.16,30.25 6.47,30.25 6.46,30.24 | 7.45,23.3 7.08,22.93 | v15.28,50.45 14.32,50.45 U$2.1 | v25.5,19.1 MD1.39 | MD1.15 28.31,33.73 29.09,34.5 33.04,34.5 33.63,35.09 33.63,38.42 32.66,39.39 25.71,39.39 25.06,38.75 21.33,38.75 20.88,38.3 20.88,35.65 20.94,35.59 | MD1.38 21.76,14.26 22.92,15.42 22.92,20.58 | MD1.39-2 23.98,22.1 23.98,23.38 | MD1.39-2 24.25,21.84 24.25,20.58
  Bottom 0.203: C19.2 C4.2 52.22,24.85 C8.1 52.18,22.51 C7.1 v52.23,20.28 52.23,16.45 51.47,15.69 43.93,15.69 42.81,14.56 42.81,12.66 | 42.81,12.66 TTL-RS1.GND | PS2.4 36.92,19.67 C12.2 38.61,16.54 39.08,16.08 v39.08,15.35 | v45.39,48.37 45.64,48.37 | 45.64,48.37 59.19,48.37 v59.72,47.84 | v19.31,49.4 19.31,49.38 18.73,48.8 15.99,48.8 15.28,49.51 v15.28,50.45 15.28,54.47 11.61,58.14 8.41,58.14 J3.SH3 | v29.61,14.21 27.11,14.21 | 27.11,14.21 26.47,14.21 25.5,15.18 v25.5,19.1 | v21.84,11.23 21.84,13.35 22.71,14.22 27.1,14.22 27.11,14.21 | CONN3.1.P5 26.46,3 25.68,3.77 12.63,3.77 v11.85,2.99 | v17.86,36 17.86,40.26 18.45,40.85 19.4,40.85 v19.43,40.82 19.43,44.17 18.93,44.67 14.42,44.67 12.34,42.59 9.57,42.59 | 9.57,42.59 8.55,42.59 8.06,43.08 J3.SH1 | v32.36,51.41 34.35,51.41 37.41,48.36 45.63,48.36 45.64,48.37 | POWER.K 4.65,41.61 5.64,42.6 9.57,42.6 9.57,42.59 | PS1.5 42.81,10.98 42.81,12.66
IO0  (via drill 0.35)
  Top 0.203: v23.18,28.32 23.15,28.34 16.93,28.34 16.84,28.26 v16.8,28.26 16.8,28.45 14.48,30.77 MD1.25 | S4.1 7.81,18.38 9.66,20.23 9.66,20.91 C10.2 10.5,20.93 11.08,21.51 11.08,29.02 v10.56,29.53
  Bottom 0.203: R8.2 44.15,30.68 42.8,32.04 36.09,32.04 35.39,31.34 35.39,29.26 Q2.3 33.2,27.03 24.92,27.03 23.64,28.32 v23.18,28.32 | v10.56,29.53 10.57,29.54 15.51,29.54 v16.8,28.26
LED_PROSES  (via drill 0.35)
  Top 0.203: R12.2 7.95,26.52 v8.47,27.04 | v14.4,32.29 17.2,29.5 28.59,29.5 29.86,28.23 MD1.12
  Bottom 0.203: v8.47,27.04 9,27.57 9,32.48 10.09,33.57 13.13,33.57 v14.4,32.29
LED_WARNING  (via drill 0.35)
  Top 0.203: R13.2 5.32,23.92 6.67,25.27 v8.43,25.27 | v17.61,33.69 18.15,33.16 MD1.23
  Bottom 0.203: v17.61,33.69 17.63,33.71 16.99,34.35 9.55,34.35 8.43,33.23 8.43,28.77 7.45,27.79 7.45,26.25 v8.43,25.27
LORA_DI0  (via drill 0.35)
  Top 0.203: LORA-NICERF-V1.DIO0 42.55,37.54 41.73,36.72 41.73,35.47 41.3,35.04 v40.7,35.04 | v26.15,28.57 26.15,27.11 27.59,25.67 31.33,25.67 MD1.10
  Bottom 0.203: v40.7,35.04 32.98,35.04 29.14,31.2 26.81,31.2 26.15,30.53 v26.15,28.57
LORA_DI1  (via drill 0.35)
  Top 0.203: LORA-NICERF-V1.DIO1 42.45,38.81 v41.36,39.9 | v24.98,28.64 24.98,26.77 28.61,23.14 31.34,23.14 MD1.8
  Bottom 0.203: v41.36,39.9 37,39.9 29,31.9 25.78,31.9 24.98,31.11 v24.98,28.64
MISO_VSPI  (via drill 0.35)
  Top 0.203: LORA-NICERF-V1.MISO 41.91,43.89 v41.91,43.9 | v19.5,23.13 13.87,23.13 MD1.31
  Bottom 0.203: v41.91,43.9 38.24,43.9 28.02,33.68 22.26,33.68 19.96,31.37 19.96,23.62 19.5,23.16 v19.5,23.13
MOSI_VSPI  (via drill 0.35)
  Top 0.203: LORA-NICERF-V1.MOSI 42.09,42.62 v42.07,42.64 | v16.61,15.53 MD1.37
  Bottom 0.203: v42.07,42.64 37.93,42.64 28.36,33.08 22.62,33.08 20.57,31.03 20.57,22.82 17.29,19.53 17.29,16.9 16.61,16.23 v16.61,15.53
N$1
  Top 0.203: Q3.1 28.34,38.09 24.04,38.09 | 24.04,38.09 23.03,38.09 C2.1 | 24.04,38.09 24.56,37.58 24.56,34.51 23.93,33.89 18.55,33.89 17.01,35.42 17.01,42.16 16.18,42.99 16.18,51.06 15.04,52.2 7.11,52.2 6.48,51.57 U$2.7
N$2
  Top 0.203: Q3.2 38.39,38.95 36.95,40.38 25.77,40.38 24.77,39.38 20.05,39.38 | C3.1 19.49,38.82 20.05,39.38 | U$2.8 5.21,51.54 6.31,52.64 15.41,52.64 16.66,51.39 16.66,43.25 18.19,41.72 18.19,39.86 18.66,39.38 20.05,39.38
N$3
  Top 0.203: R3.1 2.11,35.48 POWER.A
N$4
  Bottom 0.203: Q1.1 39.97,25.76 40.69,25.03 45.65,25.03 46.07,25.46 46.07,26.48 R1.2
N$5
  Bottom 0.203: 46.11,23.6 R2.2 47.23,23.6 47.91,24.28 47.91,27.5 47.29,28.12 40.69,28.12 38.61,30.21 37.62,30.21 Q2.1
N$6
  Bottom 1.016: CONN2P-3.5PI1.P0 61.26,8.5 | PS2.1 59.96,9.8 61.26,8.5 | 61.26,8.5 61.96,9.21 PS1.1
N$7
  Bottom 1.016: CONN2P-3.5PI1.P1 57.34,1.81 56.73,1.81 53.63,4.9 FUSE-KOTAK1.1
N$8
  Top 0.203: D1.A 15.1,38.99 R4.1
N$9
  Top 0.203: R5.1 12.29,39.03 D6.A
N$10
  Top 0.203: U3.1 35.84,51.54 38.03,49.36 38.03,42.04 37.07,41.08 26.48,41.08 24.81,42.75 R14.2
N$12  (via drill 0.35)
  Top 0.203: U$2.4 10.29,48.69 v10.32,48.67 | v13.28,54.72 13.26,54.7 C6.1
  Bottom 0.203: v10.32,48.67 10.32,53.73 11.31,54.72 v13.28,54.72
N$13
  Bottom 1.016: FUSE-KOTAK1.2 57.19,4.9 54.91,7.18 54.91,12.69 57.09,14.88 PS2.2 57.53,21.56 58.52,22.56 61.93,22.56 PS1.2
N$14
  Top 0.203: R11.2 37.45,55.7 35.43,55.7 34.57,54.84 U3.2
N$15
  Top 0.203: R10.2 20.96,43.59 21.55,44.19 24.14,44.19 26.71,41.62 36.7,41.62 37.43,42.34 37.43,48.43 33.3,52.56 U3.3
N$16  (via drill 0.35)
  Top 0.203: PS1.3 41.64,32.83 42.4,33.58 46.29,33.58 46.91,34.2 46.91,37.63 v46.29,38.26 | v54.24,20.17 54.24,8.03 53.17,6.96 38.11,6.96 37.21,7.87 PS2.5
  Bottom 0.203: D9.A 37.87,10.46 PS2.5 | v46.29,38.26 53.94,38.26 55.18,37.01 55.18,21.12 v54.24,20.17
N$25
  Top 0.203: R12.1 2.14,26.78 PROSES.A
N$28
  Top 0.203: R13.1 2.08,23.58 WARNING.A
OUT+  (via drill 0.35)
  Top 0.203: 9.3,9.81 C26.+ 9.33,7.18 11.22,7.18 12.25,6.14 U5.3 14.67,2.16 14.96,1.87 CONN3.1.P8 CONN3.1.P7 CONN3.1.P6 22.75,1.88 22.76,1.95 22.76,6.05 23.02,6.05 | C5.1 9.3,9.81 | 9.3,9.81 C11.1 v7.03,7.54 | U6.3 23.02,6.05 | v22.8,6.22 22.86,6.22 23.02,6.05 | R3.2 v5.68,35.21 | v18.42,42.93 18.42,44.23 D5.C
  Bottom 0.203: D9.C 34.51,6.46 35.11,5.86 50.04,5.86 51.72,7.54 51.72,12.59 TTL-RS1.VCC | 22.42,1.91 CONN3.1.P6 | v22.8,6.22 22.8,10.03 24.66,11.89 34.24,11.89 34.51,12.16 D9.C | D9.C 34.51,16.13 C12.1 | v18.42,42.93 16.82,42.93 15.89,42 15.89,35.71 15.4,35.21 v5.68,35.21 7.24,35.21 7.71,34.74 7.71,29.31 6.71,28.3 6.71,7.87 v7.03,7.54
RST_LORA  (via drill 0.35)
  Top 0.203: LORA-NICERF-V1.NRST 42.25,35 40.52,33.27 v39.84,33.27 | v27.45,28.46 v27.46,28.46 27.46,27.48 27.99,26.95 MD1.11
  Bottom 0.203: v39.84,33.27 32.25,33.27 29.61,30.63 28.21,30.63 27.45,29.88 v27.45,28.46
RTS  (via drill 0.35)
  Top 0.203: v38.98,23.85 38.68,24.15 38.68,27.84 39.31,28.46 42.89,28.46 44.24,29.82 v44.24,32.06 | v11.5,43.77 11.5,45.22 U$2.14
  Bottom 0.203: R2.1 43.92,23.85 v38.98,23.85 37.63,23.85 Q1.2 | v44.24,32.06 43.42,32.89 43.42,45.5 42.61,46.3 34.59,46.3 33.63,47.26 20.38,47.26 18.42,45.3 12,45.3 11.5,44.8 v11.5,43.77
RX
  Top 0.203: U$2.3 11.56,49.69 13.05,48.2 14.54,48.2 15.11,47.64 15.11,42.95 14.37,42.21 12.92,42.21 12.34,41.64 D6.C 11.13,40.88 10.53,40.28 10.53,32.08 11.82,30.78 11.82,19.33 13.08,18.07 MD1.35
RX_RS485  (via drill 0.35)
  Top 0.203: v23.53,26.92 23.46,26.92 23.42,26.87 16.24,26.87 14.89,28.23 MD1.27
  Bottom 0.203: v23.53,26.92 24.28,26.17 27.72,26.17 31.9,21.99 39.32,21.99 40.85,20.46 40.85,12.85 39.48,11.48 39.48,7.66 40.16,6.98 45,6.98 45.73,7.71 TTL-RS1.RX
SCK_VSPI  (via drill 0.35)
  Top 0.203: LORA-NICERF-V1.SCK 41.95,45.16 v41.9,45.22 | v19.1,24.44 13.87,24.44 MD1.30
  Bottom 0.203: v41.9,45.22 38.76,45.22 27.82,34.27 21.9,34.27 19.1,31.47 v19.1,24.44
SCL  (via drill 0.35)
  Top 0.203: R9.2 26.59,46.12 | 26.59,46.12 26.71,46.25 26.71,51.78 24.85,53.63 24.13,53.63 24.1,53.61 U4.10 | 26.59,46.12 v32.39,46.12 33.3,45.22 U3.14 | v18.36,16.89 18.28,16.8 MD1.36
  Bottom 0.203: CONN2P-3.5PI2.P1 47.92,3.02 46.55,4.39 20.74,4.39 19.22,5.91 19.22,14.36 | 19.22,14.36 19.22,16.14 18.48,16.89 v18.36,16.89 | v32.39,46.12 32.39,41.17 26.74,35.52 21.27,35.52 17.83,32.08 17.83,25.92 16.69,24.78 16.69,17.38 15.63,16.33 15.63,14.53 16.2,13.97 18.83,13.97 19.22,14.36
SDA  (via drill 0.35)
  Top 0.203: R6.1 24.53,48.36 | 24.53,48.36 25.67,48.36 26.12,48.81 26.12,51.63 24.61,53.13 23.9,53.13 U4.9 | U3.15 34.59,44.06 34.59,42.62 v34.54,42.57 34.17,42.2 26.86,42.2 24.35,44.7 20.54,44.7 20.23,45.01 20.23,49.36 21.49,50.61 23.76,50.61 24.53,49.84 24.53,48.36 | v19.85,19.87 19.09,20.62 17.38,20.62 | 17.38,20.62 13.86,20.62 MD1.33 | v17.59,21.6 17.59,20.84 17.38,20.62
  Bottom 0.203: CONN2P-3.5PI2.P0 51.72,2.37 48.91,5.17 21.4,5.17 20.01,6.56 20.01,19.76 19.9,19.87 v19.85,19.87 | v34.54,42.57 34.54,42.14 27.32,34.92 21.66,34.92 18.44,31.7 18.44,25.31 17.62,24.49 17.62,21.62 v17.59,21.6
SS_LORA  (via drill 0.35)
  Top 0.203: LORA-NICERF-V1.NSS 43.56,41.34 42.1,41.34 v42.08,41.32 | v21.53,25.4 14.14,25.4 MD1.29
  Bottom 0.203: v42.08,41.32 37.56,41.32 28.71,32.47 22.9,32.47 21.69,31.25 21.69,25.56 v21.53,25.4
TX
  Top 0.203: U$2.2 12.83,49.37 13.31,48.89 14.91,48.89 15.61,48.19 15.61,41.4 D1.C 15.94,40.84 16.48,40.3 16.48,33.89 15.78,33.19 13.56,33.19 13.07,32.71 13.07,31.98 12.34,31.25 12.34,19.92 12.92,19.34 MD1.34
TX_RS485  (via drill 0.35)
  Top 0.203: v23.83,25.15 22.73,26.25 15.66,26.25 14.94,26.96 MD1.28
  Bottom 0.203: TTL-RS1.TX 48.72,7.01 48.17,6.46 39.44,6.46 38.86,7.03 38.86,11.98 40.07,13.19 40.07,20.11 38.77,21.4 30.78,21.4 27.02,25.16 23.84,25.16 v23.83,25.15
USB_N
  Top 0.203: J3.2 6.29,53.62 5.25,52.58 3.02,52.58 2.46,52.01 2.46,49.21 3.48,48.19 7.1,48.19 7.65,48.73 7.73,48.82 7.75,48.84 U$2.6
USB_P
  Top 0.203: J3.3 5.64,53.47 5.1,52.93 2.87,52.93 2.2,52.26 | 2.2,52.26 | 2.2,52.26 2.1,52.16 2.1,49.06 2.2,48.96 | 2.2,48.96 | 2.2,48.96 3.23,47.94 | 3.23,47.94 | 3.23,47.94 3.33,47.83 7.25,47.83 9.03,49.61 U$2.5
VCC  (via drill 0.35)
  Top 0.203: J3.1 6.94,53.68 7.44,53.18 15.75,53.18 17.55,51.38 v17.55,47.94 17.87,47.61 D5.A | C1.1 v8.92,39.71 12.15,42.94 13.29,42.94 14.11,43.75 U$2.16 14.06,45.32 v14.06,47 | C25.+ v3.5,10.05 v3.51,10.06
  Bottom 0.203: v17.55,47.94 15,47.94 v14.06,47 | v3.51,10.06 3.51,10.61 6.04,13.14 6.04,31.81 4.76,33.09 4.76,36.76 7.78,39.79 8.95,39.79 8.95,39.74 v8.92,39.71